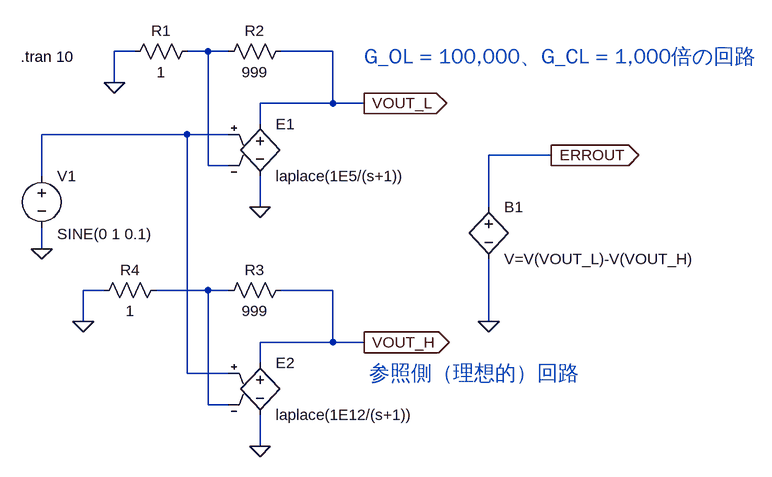
[diagram p0: schematic fig-02-03-05.asc]
fig-02-03-05.asc, the LTspice schematic file:
Version 4
SHEET 1 1496 724
WIRE 64 32 32 32
WIRE 176 32 144 32
WIRE 208 32 176 32
WIRE 368 32 288 32
WIRE 32 80 32 32
WIRE 368 112 368 32
WIRE 368 112 256 112
WIRE 416 112 368 112
WIRE 256 144 256 112
WIRE 144 160 -80 160
WIRE 208 160 144 160
WIRE 704 192 608 192
WIRE 176 208 176 32
WIRE 208 208 176 208
WIRE -80 224 -80 160
WIRE 256 272 256 224
WIRE 608 272 608 192
WIRE -80 336 -80 304
WIRE 16 400 -16 400
WIRE 176 400 96 400
WIRE 208 400 176 400
WIRE 368 400 288 400
WIRE -16 448 -16 400
WIRE 608 448 608 352
WIRE 368 480 368 400
WIRE 368 480 256 480
WIRE 416 480 368 480
WIRE 256 512 256 480
WIRE 144 528 144 160
WIRE 208 528 144 528
WIRE 176 576 176 400
WIRE 208 576 176 576
WIRE 256 640 256 592
FLAG 416 112 VOUT_L
IOPIN 416 112 Out
FLAG -80 336 0
FLAG 256 272 0
FLAG 32 80 0
FLAG 608 448 0
FLAG 704 192 ERROUT
IOPIN 704 192 Out
FLAG 416 480 VOUT_H
IOPIN 416 480 Out
FLAG 256 640 0
FLAG -16 448 0
SYMBOL res 304 16 R90
WINDOW 0 0 56 VBottom 2
WINDOW 3 32 56 VTop 2
SYMATTR InstName R2
SYMATTR Value 999
SYMBOL e 256 128 R0
SYMATTR InstName E1
SYMATTR Value laplace(1E5/(s+1))
SYMBOL voltage -80 208 R0
WINDOW 3 24 105 Left 2
WINDOW 123 24 124 Left 2
WINDOW 39 0 0 Left 0
SYMATTR Value SINE(0 1 0.1)
SYMATTR InstName V1
SYMBOL res 160 16 R90
WINDOW 0 0 56 VBottom 2
WINDOW 3 32 56 VTop 2
SYMATTR InstName R1
SYMATTR Value 1
SYMBOL bv 608 256 R0
SYMATTR InstName B1
SYMATTR Value V=V(VOUT_L)-V(VOUT_H)
SYMBOL res 304 384 R90
WINDOW 0 0 56 VBottom 2
WINDOW 3 32 56 VTop 2
SYMATTR InstName R3
SYMATTR Value 999
SYMBOL e 256 496 R0
SYMATTR InstName E2
SYMATTR Value laplace(1E12/(s+1))
SYMBOL res 112 384 R90
WINDOW 0 0 56 VBottom 2
WINDOW 3 32 56 VTop 2
SYMATTR InstName R4
SYMATTR Value 1
TEXT -112 40 Left 2 !.tran 10
TEXT 416 40 Left 3 ;G_OL = 100,000、G_CL = 1,000倍の回路
TEXT 424 528 Left 3 ;参照側（理想的）回路

The netlist it stands for:
* fig-02-03-05.asc
R2 VOUT_L N001 999
E1 VOUT_L 0 N002 N001 laplace(1E5/(s+1))
V1 N002 0 SINE(0 1 0.1)
R1 N001 0 1
B1 ERROUT 0 V=V(VOUT_L)-V(VOUT_H)
R3 VOUT_H N003 999
E2 VOUT_H 0 N002 N003 laplace(1E12/(s+1))
R4 N003 0 1
.tran 10
* G_OL = 100,000、G_CL = 1,000倍の回路
* 参照側（理想的）回路
.backanno
.end